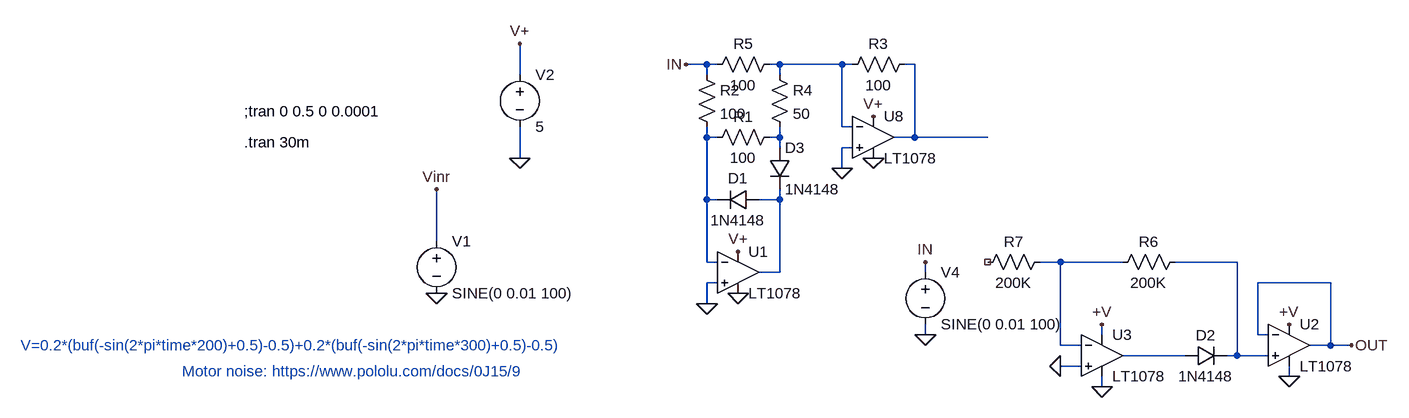
[diagram p0: schematic oscilloscope.asc]
oscilloscope.asc, the LTspice schematic file:
Version 4
SHEET 1 2292 1604
WIRE -512 -368 -544 -368
WIRE -496 -368 -512 -368
WIRE -400 -368 -416 -368
WIRE -304 -368 -400 -368
WIRE -288 -368 -304 -368
WIRE -192 -368 -208 -368
WIRE -800 -352 -800 -400
WIRE -512 -352 -512 -368
WIRE -400 -352 -400 -368
WIRE -304 -272 -304 -368
WIRE -288 -272 -304 -272
WIRE -512 -256 -512 -272
WIRE -496 -256 -512 -256
WIRE -400 -256 -400 -272
WIRE -400 -256 -416 -256
WIRE -192 -256 -192 -368
WIRE -192 -256 -224 -256
WIRE -80 -256 -192 -256
WIRE -400 -240 -400 -256
WIRE -288 -240 -304 -240
WIRE -800 -224 -800 -272
WIRE -304 -208 -304 -240
WIRE -512 -160 -512 -256
WIRE -496 -160 -512 -160
WIRE -400 -160 -400 -176
WIRE -400 -160 -432 -160
WIRE -928 -96 -928 -176
WIRE -512 -64 -512 -160
WIRE -496 -64 -512 -64
WIRE 32 -64 0 -64
WIRE 128 -64 32 -64
WIRE 304 -64 208 -64
WIRE -400 -48 -400 -160
WIRE -400 -48 -432 -48
WIRE -176 -48 -176 -64
WIRE -496 -32 -512 -32
WIRE 448 -32 336 -32
WIRE -512 0 -512 -32
WIRE -176 48 -176 32
WIRE 96 48 96 32
WIRE 336 48 336 -32
WIRE 352 48 336 48
WIRE 32 64 32 -64
WIRE 64 64 32 64
WIRE 448 64 448 -32
WIRE 448 64 416 64
WIRE 480 64 448 64
WIRE 224 80 128 80
WIRE 304 80 304 -64
WIRE 304 80 288 80
WIRE 352 80 304 80
WIRE 64 96 32 96
WIRE 384 112 384 96
WIRE 96 128 96 112
FLAG -928 -176 Vinr
FLAG -800 -400 V+
FLAG -800 -224 0
FLAG -928 -16 0
FLAG -464 -16 0
FLAG -464 -80 V+
FLAG -256 -224 0
FLAG -256 -288 V+
FLAG -304 -208 0
FLAG -512 0 0
FLAG 96 32 +V
FLAG -176 48 0
FLAG 96 128 0
FLAG 384 112 0
FLAG -176 -64 IN
FLAG 480 64 OUT
FLAG 32 96 0
FLAG 384 32 +V
FLAG -544 -368 IN
SYMBOL Opamps\\opamp2 -464 -112 R0
SYMATTR InstName U1
SYMATTR Value LT1078
SYMBOL diode -432 -176 R90
WINDOW 0 -1 32 VBottom 2
WINDOW 3 32 32 VTop 2
SYMATTR InstName D1
SYMATTR Value 1N4148
SYMBOL res -192 -384 R90
WINDOW 0 0 56 VBottom 2
WINDOW 3 32 56 VTop 2
SYMATTR InstName R3
SYMATTR Value 100
SYMBOL Opamps\\opamp2 -256 -320 R0
SYMATTR InstName U8
SYMATTR Value LT1078
SYMBOL res -400 -272 R90
WINDOW 0 0 56 VBottom 2
WINDOW 3 32 56 VTop 2
SYMATTR InstName R1
SYMATTR Value 100
SYMBOL res -528 -368 R0
SYMATTR InstName R2
SYMATTR Value 100
SYMBOL res -416 -368 R0
SYMATTR InstName R4
SYMATTR Value 50
SYMBOL res -400 -384 R90
WINDOW 0 0 56 VBottom 2
WINDOW 3 32 56 VTop 2
SYMATTR InstName R5
SYMATTR Value 100
SYMBOL diode -416 -240 R0
SYMATTR InstName D3
SYMATTR Value 1N4148
SYMBOL voltage -928 -112 R0
WINDOW 123 0 0 Left 0
WINDOW 39 0 0 Left 0
SYMATTR InstName V1
SYMATTR Value SINE(0 0.01 100)
SYMBOL voltage -800 -368 R0
SYMATTR InstName V2
SYMATTR Value 5
SYMBOL res 224 -80 R90
WINDOW 0 0 56 VBottom 2
WINDOW 3 32 56 VTop 2
SYMATTR InstName R6
SYMATTR Value 200K
SYMBOL res 16 -80 R90
WINDOW 0 0 56 VBottom 2
WINDOW 3 32 56 VTop 2
SYMATTR InstName R7
SYMATTR Value 200K
SYMBOL voltage -176 -64 R0
WINDOW 123 0 0 Left 0
WINDOW 39 0 0 Left 0
SYMATTR InstName V4
SYMATTR Value SINE(0 0.01 100)
SYMBOL diode 224 96 R270
WINDOW 0 32 32 VTop 2
WINDOW 3 0 32 VBottom 2
SYMATTR InstName D2
SYMATTR Value 1N4148
SYMBOL Opamps\\opamp2 384 0 R0
SYMATTR InstName U2
SYMATTR Value LT1078
SYMBOL Opamps\\opamp2 96 16 R0
SYMATTR InstName U3
SYMATTR Value LT1078
TEXT -1224 -296 Left 2 !;tran 0 0.5 0 0.0001
TEXT -1320 104 Left 2 ;Motor noise: https://www.pololu.com/docs/0J15/9
TEXT -1568 64 Left 2 ;V=0.2*(buf(-sin(2*pi*time*200)+0.5)-0.5)+0.2*(buf(-sin(2*pi*time*300)+0.5)-0.5)
TEXT -1224 -248 Left 2 !.tran 30m

The netlist it stands for:
* oscilloscope.asc
XU1 0 N003 V+ 0 N005 LT1078  ; pins In+ In- V+ V- OUT
D1 N005 N003 1N4148
R3 N002 N001 100
XU8 0 N001 V+ 0 N002 LT1078  ; pins In+ In- V+ V- OUT
R1 N004 N003 100
R2 IN N003 100
R4 N001 N004 50
R5 N001 IN 100
D3 N004 N005 1N4148
V1 Vinr 0 SINE(0 0.01 100)
V2 V+ 0 5
R6 N007 N006 200K
R7 N006 NC_01 200K
V4 IN 0 SINE(0 0.01 100)
D2 N008 N007 1N4148
XU2 N007 OUT +V 0 OUT LT1078  ; pins In+ In- V+ V- OUT
XU3 0 N006 +V 0 N008 LT1078  ; pins In+ In- V+ V- OUT
.model D D
.lib standard.dio
;tran 0 0.5 0 0.0001
* Motor noise: https://www.pololu.com/docs/0J15/9
* V=0.2*(buf(-sin(2*pi*time*200)+0.5)-0.5)+0.2*(buf(-sin(2*pi*time*300)+0.5)-0.5)
.tran 30m
.backanno
.end